# Altium schematic sheet 12V_Converter.SchDoc
size A; SheetNumber: 6; SheetTotal: 9
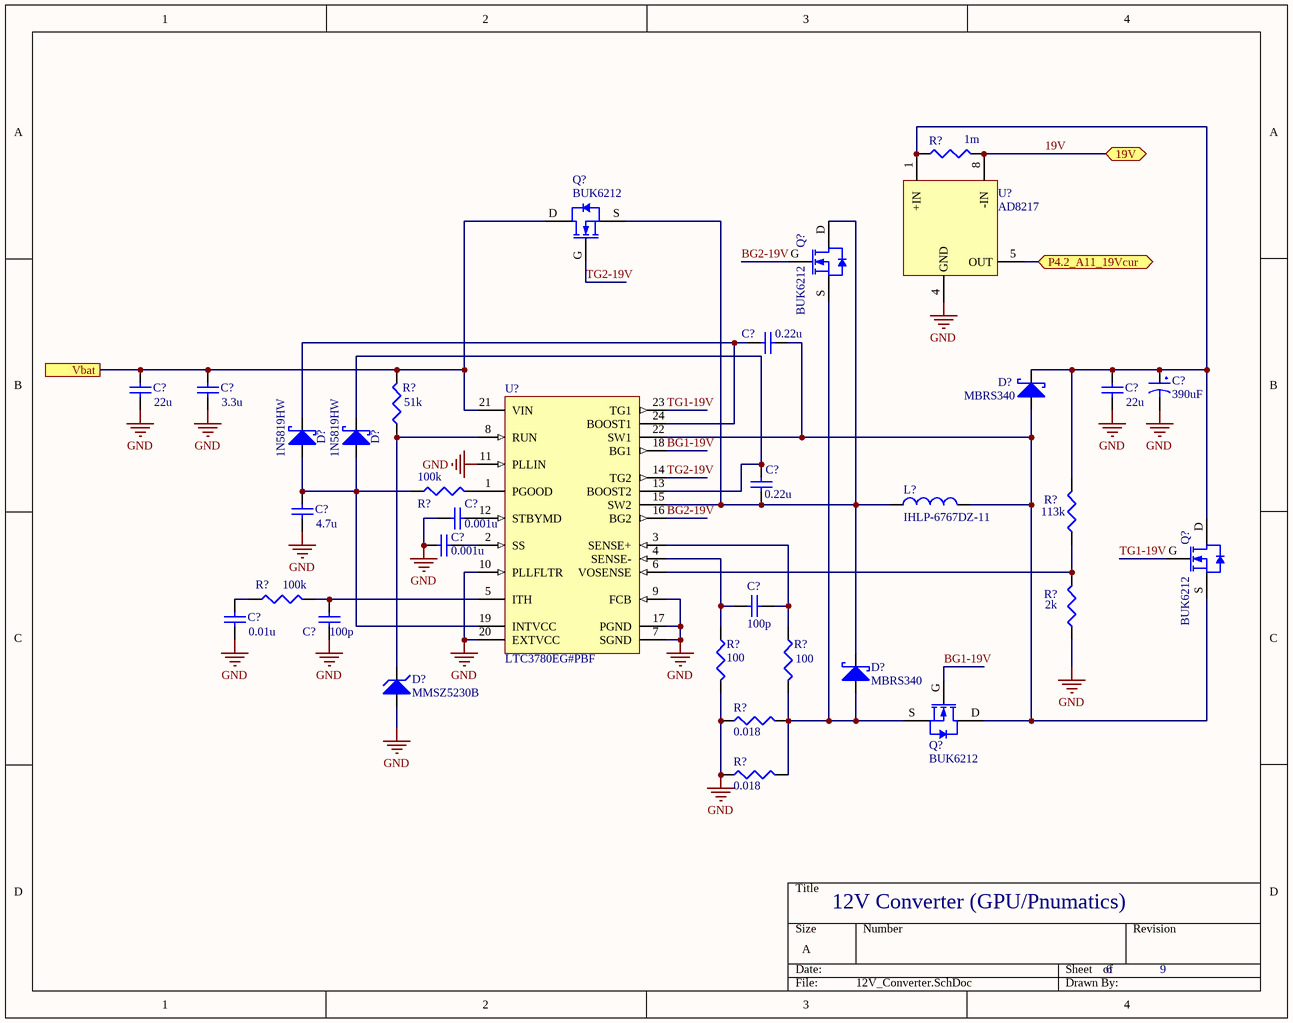
[diagram p0: 12V_Converter.SchDoc]

## Parts
(Parts that share a designator on the sheet are numbered #1, #2 ... from top to bottom, then left to right.)
C?#1  value 0.22u  [C1206]  (hidden comment: Cap Semi)
C?#2  value 22u  [C1206]  (hidden comment: Cap Semi)
C?#3  value 3.3u  [C1206]  (hidden comment: Cap Semi)
C?#4  value 22u  [C1206]  (hidden comment: Cap Semi)
C?#5  390uF  [PCVxxxxxMCLxGS]
C?#6  value 0.22u  [C1206]  (hidden comment: Cap Semi)
C?#7  value 0.001u  [C1206]  (hidden comment: Cap Semi)
C?#8  value 4.7u  [C1206]  (hidden comment: Cap Semi)
C?#9  value 0.001u  [C1206]  (hidden comment: Cap Semi)
C?#10  value 100p  [C1206]  (hidden comment: Cap Semi)
C?#11  value 0.01u  [C1206]  (hidden comment: Cap Semi)
C?#12  value 100p  [C1206]  (hidden comment: Cap Semi)
D?#1  MBRS340  [MBRS340]
D?#2  1N5819HW  [1N58xx]
D?#3  1N5819HW  [1N58xx]
D?#4  MMSZ5230B  [ONSC-SOD-123-2-425-04_V]
D?#5  MBRS340  [MBRS340]
L?  IHLP-6767DZ-11  [IHLP-6767DZ-11]
Q?#1  BUK6212  [NXP-SOT428_M]
Q?#2  BUK6212  [NXP-SOT428_M]
Q?#3  BUK6212  [NXP-SOT428_M]
Q?#4  BUK6212  [NXP-SOT428_M]
R?#1  value 1m  [14-1210]  (hidden comment: Res3)
R?#2  value 51k  [J1-0603]  (hidden comment: Res3)
R?#3  value 100k  [J1-0603]  (hidden comment: Res3)
R?#4  value 113k  [J1-0603]  (hidden comment: Res3)
R?#5  value 100k  [J1-0603]  (hidden comment: Res3)
R?#6  value 2k  [J1-0603]  (hidden comment: Res3)
R?#7  value 100  [J1-0603]  (hidden comment: Res3)
R?#8  value 100  [J1-0603]  (hidden comment: Res3)
R?#9  value 0.018  [R1206]  (hidden comment: Res3)
R?#10  value 0.018  [R1206]  (hidden comment: Res3)
U?#1  AD8217  [AD8217]
U?#2  LTC3780EG#PBF  [LT-G-24_L]

## Ports
19V (bidir), P4.2_A11_19Vcur (bidir), Vbat

## Nets
GND: C?#2.1 C?#3.1 C?#4.1 C?#5.2 C?#7.1 C?#8.1 C?#9.1 C?#11.1 C?#12.1 D?#4.2(A) R?#6.1 R?#7.2 R?#9.1 R?#10.1 U?#1.4(GND) U?#2.7(SGND) U?#2.9(FCB) U?#2.10(PLLFLTR) U?#2.11(PLLIN) U?#2.17(PGND) U?#2.20(EXTVCC)
19V: R?#1.2 U?#1.8(-IN) ; port 19V
BG1-19V: Q?#4.G U?#2.18(BG1)
BG2-19V: Q?#2.G U?#2.16(BG2)
P4.2_A11_19Vcur: U?#1.5(OUT) ; port P4.2_A11_19Vcur
TG1-19V: Q?#3.G U?#2.23(TG1)
TG2-19V: Q?#1.G U?#2.14(TG2)
Vbat: C?#2.2 C?#3.2 Q?#1.D R?#2.2 U?#2.21(VIN) ; port Vbat
NetC?#1_1: C?#1.1 D?#1.A(Anode) L?.2 Q?#3.S Q?#4.D U?#2.22(SW1)
NetC?#1_2: C?#1.2 D?#2.K(Cathode) U?#2.24(BOOST1)
NetC?#4_2: C?#4.2 C?#5.1 D?#1.K(Cathode) Q?#3.D R?#1.1 R?#4.2 U?#1.1(+IN)
NetC?#6_1: C?#6.1 D?#5.K(Cathode) L?.1 Q?#1.S Q?#2.D U?#2.15(SW2)
NetC?#6_2: C?#6.2 D?#3.K(Cathode) U?#2.13(BOOST2)
NetC?#7_2: C?#7.2 U?#2.12(STBYMD)
NetC?#8_2: C?#8.2 D?#2.A(Anode) D?#3.A(Anode) R?#3.1 U?#2.19(INTVCC)
NetC?#9_2: C?#9.2 U?#2.2(SS)
NetC?#10_1: C?#10.1 R?#7.1 U?#2.4(SENSE-)
NetC?#10_2: C?#10.2 R?#8.1 U?#2.3(SENSE+)
NetC?#11_2: C?#11.2 R?#5.1
NetC?#12_2: C?#12.2 R?#5.2 U?#2.5(ITH)
NetD?#4_1: D?#4.1(K) R?#2.1 U?#2.8(RUN)
NetD?#5_A: D?#5.A(Anode) Q?#2.S Q?#4.S R?#8.2 R?#9.2 R?#10.2
NetR?#3_2: R?#3.2 U?#2.1(PGOOD)
NetR?#4_1: R?#4.1 R?#6.2 U?#2.6(VOSENSE)

## Notes on the sheet
- 12V Converter (GPU/Pnumatics)

## Library data of the parts
C?#1-C?#4 C?#6-C?#12 = Cap Semi: Capacitor (Semiconductor SIM Model); Published: 8-Jun-2000; LatestRevisionDate: 29-May-2009; LatestRevisionNote: IPC-7351 Footprint Added.; PackageReference: C1206; Publisher: Altium Limited; PackageDescription: Chip Capacitor
C?#5 = PCV1E391MCL2GS: CAP ALUM POLY 390UF 20% 25V SMD; Digikey: https://www.digikey.com/product-detail/en/nichicon/PCV1E391MCL2GS/493-4544-1-ND/2786841; Datasheet: http://nichicon-us.com/english/products/pdfs/e-pcv.pdf
D?#1 D?#5 = MBRS340: Schottky Rectifier; Datasheet: https://www.mouser.com/ds/2/308/MBRS340-1120985.pdf
D?#2 D?#3 = 1N58xx: 1A Schottky Barrier Rectifier Diode; Datasheet: http://www.kesenes.com/pdf/1n5817-1n5819.pdf
D?#4 = MMSZ5230BT1G: Zener Voltage Regulator, 500 mW, 2-Pin SOD-123, Pb-Free, Tape and Reel; Manufacturer: On Semiconductor; P Max (W): 0.5; VZ Typ (V): 4.7; DatasheetVersion: Rev. 12; PackageVersion: Rev. G, 10/2009; PackageReference: SOD-123-2-425-04; PackageDescription: 2-Pin SOD, Body 1.6 x 2.69 mm; Supplier 1: Digi-Key; Supplier Part Number 1: MMSZ5230BT1GOSTR-ND; Supplier 2: Digi-Key; Supplier Part Number 2: MMSZ5230BT1GOSCT-ND; Supplier 3: Digi-Key; Supplier Part Number 3: MMSZ5230BT1GOSDKR-ND; Supplier 4: Farnell; Supplier Part Number 4: 1431272; Supplier 5: Farnell; Supplier Part Number 5: 1431272RL; Supplier 6: Farnell; Supplier Part Number 6: 2370826; Supplier 7: Newark; Supplier Part Number 7: 83H7423; Supplier 8: Newark; Supplier Part Number 8: 67R1368; Supplier 9: Mouser; Supplier Part Number 9: 863-MMSZ5230BT1G; Packing: Tape and Reel; RoHS: Pb-Free; Mounting Technology: Surface Mount; PartNumber: MMSZ5230BT1G; ComponentLink1Description: Manufacturer URL; ComponentLink1URL: http://www.onsemi.com/; ComponentLink2Description: Datasheet; ComponentLink2URL: http://www.onsemi.com/pub_link/Collateral/MMSZ5221BT1-D.PDF; ComponentLink3Description: Package Specification; ComponentLink3URL: http://www.onsemi.com/pub_link/Collateral/425-04.PDF
L? = IHLP-6767DZ-11: 15µH Shielded Molded Inductor 14A 14.4 mOhm Max Nonstandard; Datasheet: http://www.vishay.com/docs/34306/lp67dz11.pdf; Digikey: https://www.digikey.com/product-detail/en/vishay-dale/IHLP6767GZER150M11/541-1287-1-ND/2139413
Q?#1-Q?#4 = BUK6212: N-Channel TrenchMOS Intermediate Level FET, 40 V, 50 A, 3-Pin SOT428, Tape and Reel; Manufacturer: NXP Semiconductors; PartNumber: BUK6212-40C,118; Automotive Qualified: Y; Channel Type: N; ID [max] (A): 50; IDM [max] (A): 233; Packing: Tape & Reel; Qr [typ] (nC): 38; VDS [max] (V): 40; VGSth [typ] (V): 2.3; DatasheetVersion: Rev. 2; PackageVersion: 14-06-10, 06/2014; PackageReference: SOT428; PackageDescription: 3-Pin Plastic Single-ended Surface Mounted Package, Body 6.1 x 6.6 mm, Pitch 2.285 mm; Supplier 1: Digi-Key; Supplier Part Number 1: 568-6983-2-ND; Supplier 2: Digi-Key; Supplier Part Number 2: 568-6983-1-ND; Supplier 3: Digi-Key; Supplier Part Number 3: 568-6983-6-ND; Supplier 4: Mouser; Supplier Part Number 4: 771-BUK621240C118; Mounting Technology: Surface Mount; Code_JEITA: SC-63; Code_JEDEC: TO-252; ComponentLink1Description: Manufacturer URL; ComponentLink1URL: http://www.nxp.com/; ComponentLink2Description: Datasheet; ComponentLink2URL: http://www.nxp.com/documents/data_sheet/BUK6212-40C.pdf; ComponentLink3Description: Package Specification; ComponentLink3URL: http://www.nxp.com/documents/outline_drawing/sot428_po.pdf
R?#1-R?#10 = Res3: Resistor; Published: 8-Jun-2000; LatestRevisionDate: 29-May-2009; LatestRevisionNote: IPC-7351 Footprint Added.; PackageReference: J1-0603; Publisher: Altium Limited; PackageDescription: Chip Resistor
U?#1 = AD8217: High Resolution, Zero-Drift  Current Shunt Monitor; Datasheet: https://www.analog.com/media/en/technical-documentation/data-sheets/AD8217.pdf
U?#2 = LTC3780EG#PBF: Buck-boost Controller, Constant Frequency, Current Mode Control with Power Good Output, 24-pin SOP (G-24), -40 to 85 degC, Pb-Free; Manufacturer: Linear Technology; Frequency Sync Range: 200kHz - 400kHz; Number of Outputs: 1; DatasheetVersion: Rev. F; PackageVersion: Jun-10; PackageReference: G-24; PackageDescription: 24-Pin Plastic SSOP, Body 8.2 x 5.3 mm, Pitch 0.65 mm; Supplier 1: Digi-Key; Supplier Part Number 1: LTC3780EG#PBF-ND; Supplier 2: Farnell; Supplier Part Number 2: 1273545; Supplier 3: Newark; Supplier Part Number 3: 56M8395; RoHS: TRUE; Mounting Technology: Surface Mount; PartNumber: LTC3780EG#PBF; ComponentLink1Description: Manufacturer URL; ComponentLink1URL: http://www.linear.com/; ComponentLink2Description: Datasheet; ComponentLink2URL: http://cds.linear.com/docs/en/datasheet/3780ff.pdf; ComponentLink3Description: Package Specification; ComponentLink3URL: http://cds.linear.com/docs/en/packaging/SSOP_24_05-08-1640.pdf